# Altium schematic sheet Motor Circuit.SchDoc
size A4; SheetNumber: 5; SheetTotal: 5
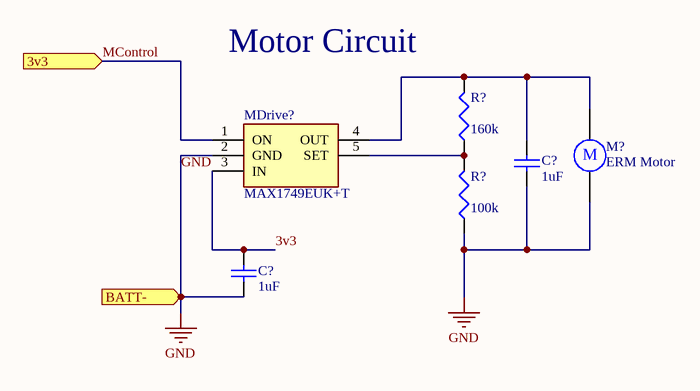
[diagram p0: Motor Circuit.SchDoc]

## Parts
(Parts that share a designator on the sheet are numbered #1, #2 ... from top to bottom, then left to right.)
C?#1  1uF  [CAPC1608X90X35ML15T15]
C?#2  1uF  [CAPC1608X90X35ML15T15]
M?  ERM Motor  [RB5-10.5]
MDrive?  MAX1749EUK+T  [SOT95P280X145-5N]
R?#1  value 160k  [J1-0603]  (hidden comment: Res3)
R?#2  value 100k  [J1-0603]  (hidden comment: Res3)

## Ports
3v3 (in), BATT- (in)

## Nets
GND: C?#1.1 C?#2.1 M?.2 MDrive?.2(GND) R?#2.1 ; port BATT-
3v3: C?#2.2 MDrive?.3(IN)
MControl: MDrive?.1(ON) ; port 3v3
NetC?#1_2: C?#1.2 M?.1 MDrive?.4(OUT) R?#1.2
NetMDrive?_5: MDrive?.5(SET) R?#1.1 R?#2.2

## Notes on the sheet
- (near R?#1) Motor Circuit
- (in symbol Motor) M

## Library data of the parts
C?#1 C?#2 = CMP-2006-04472-1: Manufacturer: AVX Interconnect / Elco; Part Number: 06036C105KAT2A
M? = Motor: VC1234B016F; Published: 24-Mar-1999; LatestRevisionDate: 17-Jul-2002; LatestRevisionNote: Re-released for DXP Platform.; PackageReference: RB5-10.5; Publisher: Altium Limited; PackageDescription: Capacitor (Radial); 2 Leads
MDrive? = MAX1749EUK+T: Integrated Circuit; Manufacturer_Name: Maxim Integrated; Datasheet Link: https://pdfserv.maximintegrated.com/en/ds/MAX1749.pdf; Height: 1.45mm; Manufacturer_Part_Number: MAX1749EUK+T
R?#1 R?#2 = Res3: Resistor; Published: 8-Jun-2000; LatestRevisionDate: 29-May-2009; LatestRevisionNote: IPC-7351 Footprint Added.; PackageReference: J1-0603; Publisher: Altium Limited; PackageDescription: Chip Resistor